# EAGLE design Arduino_backplane (EAGLE 6.4)
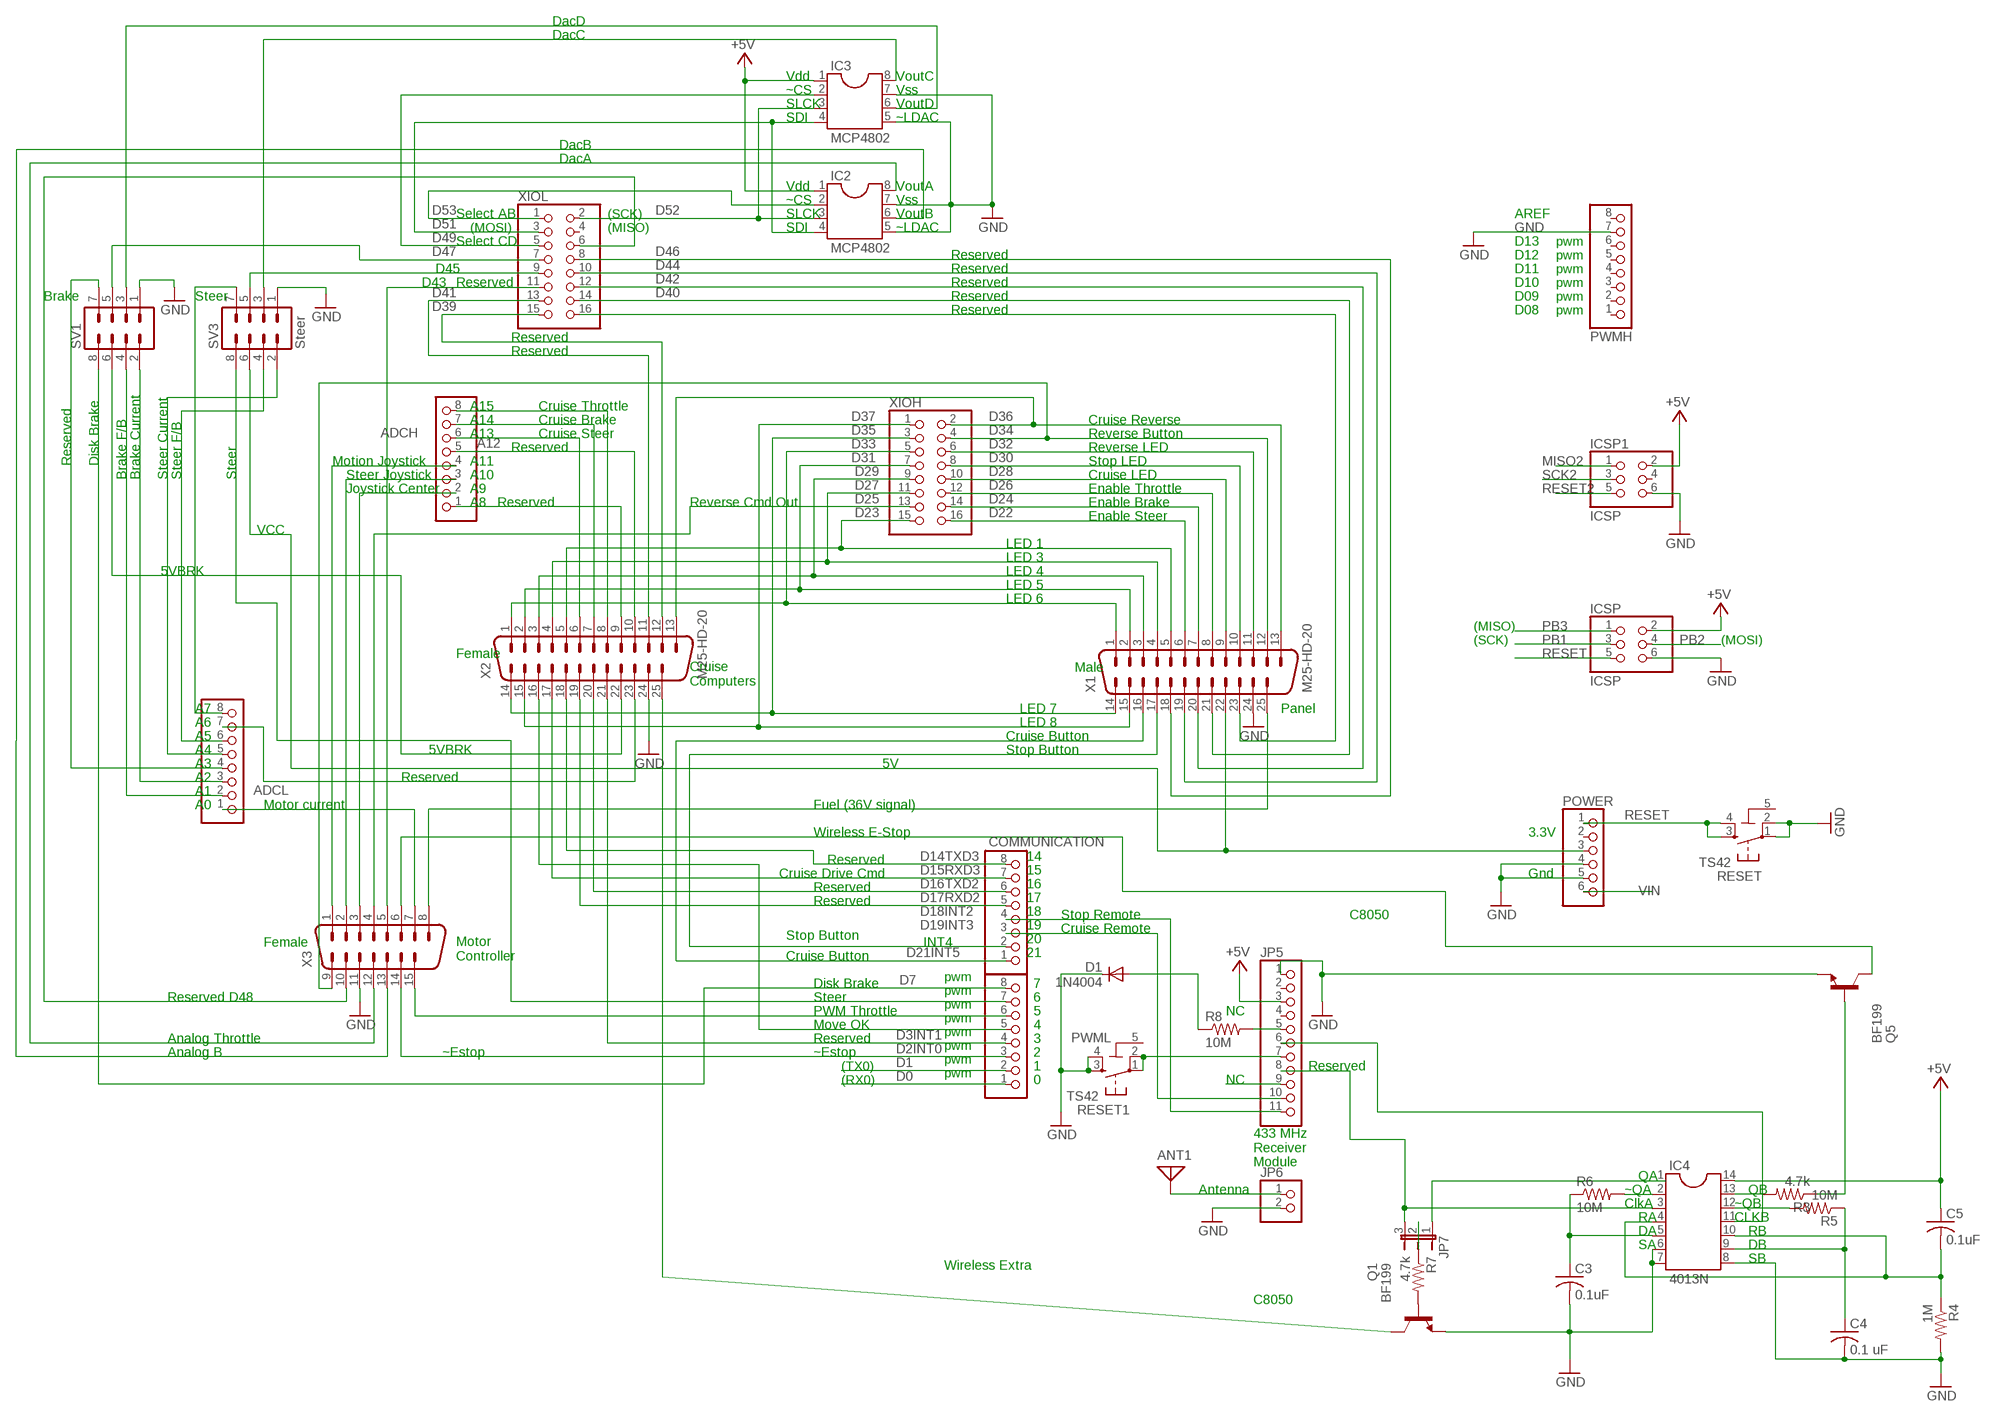
[diagram p0: schematic, sheet 1]

## Parts
ADCH  PINHD-1X8  [1X08]
ADCL  PINHD-1X8  [1X08]
ANT1  ANTENNA  [PAD-01]
C3  0.1uF  C-US025-025X050  [C025-025X050]
C4  0.1 uF  C-US025-025X050  [C025-025X050]
C5  0.1uF  C-US025-025X050  [C025-025X050]
COMMUNICATION  PINHD-1X8  [1X08]
D1  1N4004  [DO41-10]
IC2  MCP4802  DIL8  [DIL08]
IC3  MCP4802  DIL8  [DIL08]
IC4  4013N  DIL14  [DIL14]
ICSP  ICSP  PINHD-2X3  [2X03]
ICSP1  ICSP  PINHD-2X3  [2X03]
JP5  PINHD-1X11  [1X11]
JP6  PINHD-1X2  [1X02]
JP7  JP2E  [JP2]
POWER  PINHD-1X6  [1X06]
PWMH  PINHD-1X8  [1X08]
PWML  PINHD-1X8  [1X08]
Q1  BF199  [TO92]
Q5  BF199  [TO92]
R3  4.7k  R-US_0204/5  [0204/5]
R4  1M  R-US_0204/5  [0204/5]
R5  10M  R-US_0204/5  [0204/5]
R6  10M  R-US_0204/5  [0204/5]
R7  4.7k  R-US_0204/5  [0204/5]
R8  10M  R-US_0204/5  [0204/5]
RESET  TS42  [TS42]
RESET1  TS42  [TS42]
SV1  MA04-2  [MA04-2]
SV3  Steer  MA04-2  [MA04-2]
X1  M25-HD-20  [M25-HD-20]
X2  M25-HD-20  [M25-HD-20]
X3  M15HP  [M15HP]
XIOH  PINHD-2X8  [2X08]
XIOL  PINHD-2X8  [2X08]

## Nets
5VBRK: SV1.6 X2.22
+5V: C5.1 IC2.1 IC3.1 IC4.14 ICSP1.2 ICSP.2 JP5.3
A0: ADCL.1 X3.7
A1: ADCL.2 SV1.4
A3: ADCL.4 SV1.7
A4: ADCL.5 SV3.2
A5: ADCL.6 SV3.4
A6: ADCL.7 X2.23
A7: ADCL.8 SV3.7
A9: ADCH.2 X3.3
A10: ADCH.3 X3.2
A11: ADCH.4 X3.1
A12: ADCH.5 X2.10
A13: ADCH.6 X2.6
A14: ADCH.7 X2.7
A15: ADCH.8 X2.8
CLKA: IC4.3 JP5.8 JP7.3
CLKB: IC4.11 JP5.6
D0: PWML.1
D1: PWML.2
D2INT0: PWML.3 X3.14
D3INT1: PWML.4 X2.21
D4: PWML.5 X2.16
D5: PWML.6 X3.15
D6: PWML.7 SV3.8
D7: PWML.8 SV1.8
D14TXD3: COMMUNICATION.8 X2.18
D15RXD3: COMMUNICATION.7 X2.17
D16TXD2: COMMUNICATION.6 X2.20
D17RXD2: COMMUNICATION.5 X2.19
D18INT2: COMMUNICATION.4 JP5.11
D19INT3: COMMUNICATION.3 JP5.10
D20INT4: COMMUNICATION.2 X1.17
D21INT5: COMMUNICATION.1 X1.16
D22: X1.6 XIOH.16
D23: ADCH.1 X1.5 X2.5 X2.9 XIOH.15
D24: X1.7 XIOH.14
D25: X3.4 XIOH.13
D26: X1.8 XIOH.12
D27: X1.4 X2.4 XIOH.11
D28: X1.9 XIOH.10
D29: X1.3 X2.3 XIOH.9
D30: X1.10 XIOH.8
D31: X1.2 X2.2 XIOH.7
D32: X1.11 XIOH.6
D33: X1.1 X2.1 XIOH.5
D34: X1.12 XIOH.4
D35: X1.14 X2.14 XIOH.3
D36: X1.13 X2.13 XIOH.2
D37: X1.15 X2.15 XIOH.1
D38: X1.23 XIOL.16
D39: X2.12 XIOL.15
D40: X1.21 XIOL.14
D41: X2.11 XIOL.13
D42: X1.20 XIOL.12
D43: X3.5 XIOL.11
D44: X1.19 XIOL.10
D45: SV3.5 XIOL.9
D46: X1.18 XIOL.8
D47: SV1.5 XIOL.7
D48: X3.10 XIOL.6
D49: IC3.2 XIOL.5
D51: IC2.4 IC3.4 XIOL.3
D52: IC2.3 IC3.3 XIOL.2
D53: IC2.2 XIOL.1
DA: C3.1 IC4.5 R6.1
DACA: IC2.8 X3.12
DACB: IC2.6 X3.13
DACC: IC3.8 SV3.3
DACD: IC3.6 SV1.3
DB: C4.1 IC4.9 R5.1
FUEL: X1.25 X3.8
GND: C3.2 C4.2 D1.C IC2.5 IC2.7 IC3.5 IC3.7 IC4.6 IC4.7 IC4.8 ICSP1.6 ICSP.6 JP5.1 JP6.2 POWER.4 POWER.5 PWMH.7 Q1.2(E) Q5.2(E) R4.2 RESET1.3 RESET1.4 RESET.1 RESET.2 SV1.1 SV3.1 X1.24 X2.24 X3.11
MISO2: ICSP1.1
N$1: ADCL.3 SV1.2
N$3: JP5.5 R8.2
N$11: JP7.2 R7.1
N$12: Q1.1(B) R7.2
N$26: ANT1.1 JP6.1
N$28: JP5.7 RESET1.1 RESET1.2
N$29: JP5.9
N$33: Q5.1(B) R3.1
N$40: D1.A R8.1
PB1: ICSP.3
PB2: ICSP.4
PB3: ICSP.1
QA: IC4.1 JP7.1
QB: R3.2
RA: C5.2 IC4.4 IC4.10 R4.1
RESET: ICSP.5 POWER.1 RESET.3 RESET.4
RESET2: ICSP1.5
SCK2: ICSP1.3
VCC: POWER.3 SV3.6 X1.22
VIN: POWER.6
WLES: Q5.3(C) X3.6
WLX: Q1.3(C) X2.25
~QA: IC4.2 R6.2
~QB: IC4.12 R5.2
Unconnected: IC4.13 ICSP1.4 JP5.2 JP5.4 POWER.2 PWMH.1 PWMH.2 PWMH.3 PWMH.4 PWMH.5 PWMH.6 PWMH.8 X3.9 XIOL.4

## Notes on the sheet
- DacD
- DacC
- Vdd | VoutC
- ~CS | Vss
- SLCK | VoutD
- SDI | ~LDAC
- DacB
- DacA
- Vdd | VoutA
- ~CS | Vss
- Select AB | (SCK) | SLCK | VoutB | AREF
- (MOSI) | (MISO) | SDI | ~LDAC
- Select CD | D13 | pwm
- Reserved | D12 | pwm
- D45 | Reserved | D11 | pwm
- D43 | Reserved | Reserved | D10 | pwm
- Brake | Steer | Reserved | D09 | pwm
- Reserved | D08 | pwm
- Reserved
- Reserved
- A15 | Cruise Throttle
- A14 | Cruise Brake | Cruise Reverse
- A13 | Cruise Steer | Reverse Button
- Reserved | Reverse LED
- Reserved | Disk Brake | Motion Joystick | A11 | Stop LED
- Brake F/B | Brake Current | Steer Current | Steer F/B | Steer | Steer Joystick | A10 | Cruise LED
- Joystick Center | A9 | Enable Throttle
- A8 | Reserved | Reverse Cmd Out | Enable Brake
- Enable Steer
- VCC
- LED 1
- LED 3
- 5VBRK | LED 4
- LED 5
- LED 6
- (MISO)
- (SCK) | (MOSI)
- Female
- Male
- Cruise
  Computers
- A7 | LED 7 | Panel
- A6 | LED 8
- A5 | Cruise Button
- A4 | 5VBRK | Stop Button
- A3 | 5V
- A2 | Reserved
- A1
- A0 | Motor current | Fuel (36V signal)
- Wireless E-Stop | 3.3V
- Reserved | 14
- Cruise Drive Cmd | 15 | Gnd
- Reserved | 16
- Reserved | 17
- 18 | Stop Remote | C8050
- 19 | Cruise Remote
- Stop Button | 20
- Female | INT4
- 21
- Motor
  Controller
- Cruise Button
- pwm
- Disk Brake | 7
- pwm
- Reserved D48 | Steer | 6
- pwm
- PWM Throttle | 5 | NC
- pwm
- Move OK | 4
- pwm
- Analog Throttle | Reserved | 3
- pwm
- Analog B | ~Estop | ~Estop | 2
- pwm
- (TX0) | 1 | Reserved
- pwm
- (RX0) | 0 | NC
- 433 MHz
  Receiver
  Module
- QA
- Antenna | ~QA | QB
- ClkA | ~QB
- RA | CLKB
- DA | RB
- SA | DB
- SB
- Wireless Extra
- C8050

## Power pins joined to a net without a drawn wire
5-GND: RESET1.5(5-GND) RESET.5(5-GND)

## Library data of the parts
ADCH ADCL COMMUNICATION PWMH PWML = pinhead:PINHD-1X8: PIN HEADER
ANT1 = discrete:ANTENNA: Antenna
C3-C5 = rcl:C-US: CAPACITOR, American symbol
D1 = diode:1N4004: DIODE general purpose rectifier, 1 A
IC2 IC3 = ic-package:DIL8: Dual In Line / Socket
IC4 = ic-package:DIL14: Dual In Line / Socket
ICSP ICSP1 = pinhead:PINHD-2X3: PIN HEADER
JP5 = pinhead:PINHD-1X11: PIN HEADER
JP6 = pinhead:PINHD-1X2: PIN HEADER
JP7 = jumper:JP2E: JUMPER
POWER = pinhead:PINHD-1X6: PIN HEADER
Q1 Q5 = transistor-npn:BF199*: NPN Transistor
R3-R8 = rcl:R-US_: RESISTOR, American symbol
RESET RESET1 = st-mod v1.4:TS42: TS42 Dongnan Electronics Tact switch VDC 12V - 50mA
SV1 SV3 = con-lstb:MA04-2: PIN HEADER; OC_FARNELL: unknown; OC_NEWARK: unknown
X1 X2 = con-subd:M25-HD-20: HD-20 Front Metal-Shell Right-Angle Posted Connectors 318 Mount 5747846-6 Source: http://catalog.tycoelectronics.com/TE/bin/TE.Connect?C=1&M=BYPN&TCPN=5747846-6&RQPN=5747846-6; OC_FARNELL: unknown; OC_NEWARK: unknown
X3 = con-subd:M15: SUB-D; OC_FARNELL: unknown; OC_NEWARK: unknown
XIOH XIOL = pinhead:PINHD-2X8: PIN HEADER

## Net classes
0 default: width 0.152 mm, drill 0.305 mm, clearance 0.152 mm

## Board
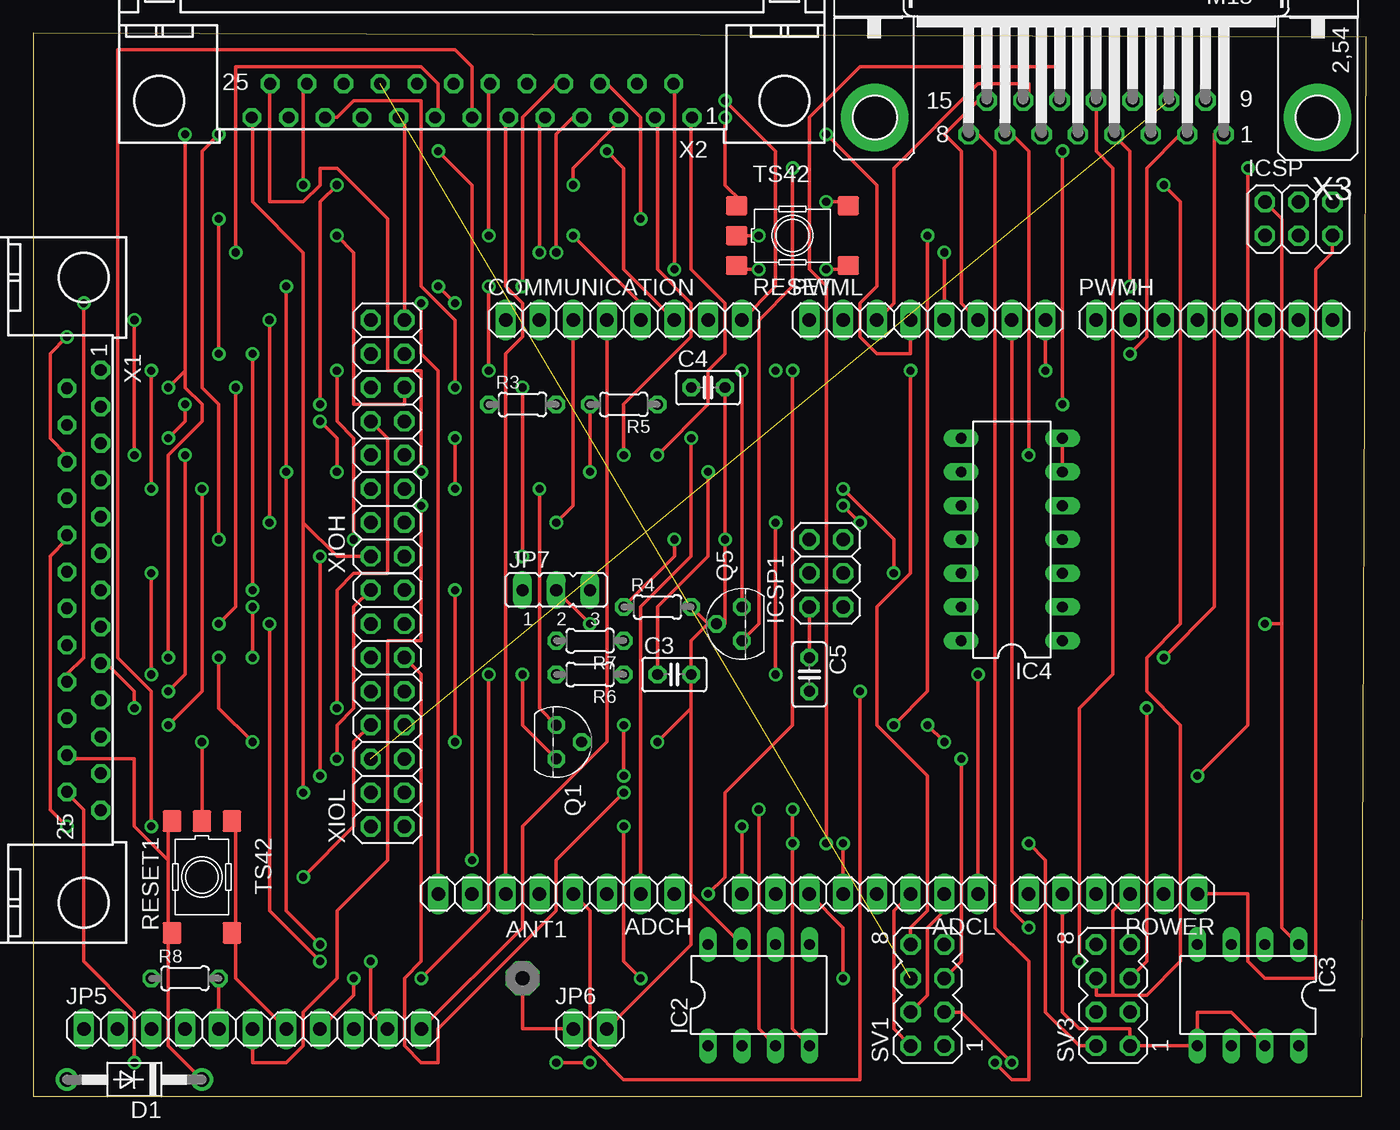
[diagram p1: board, top side]
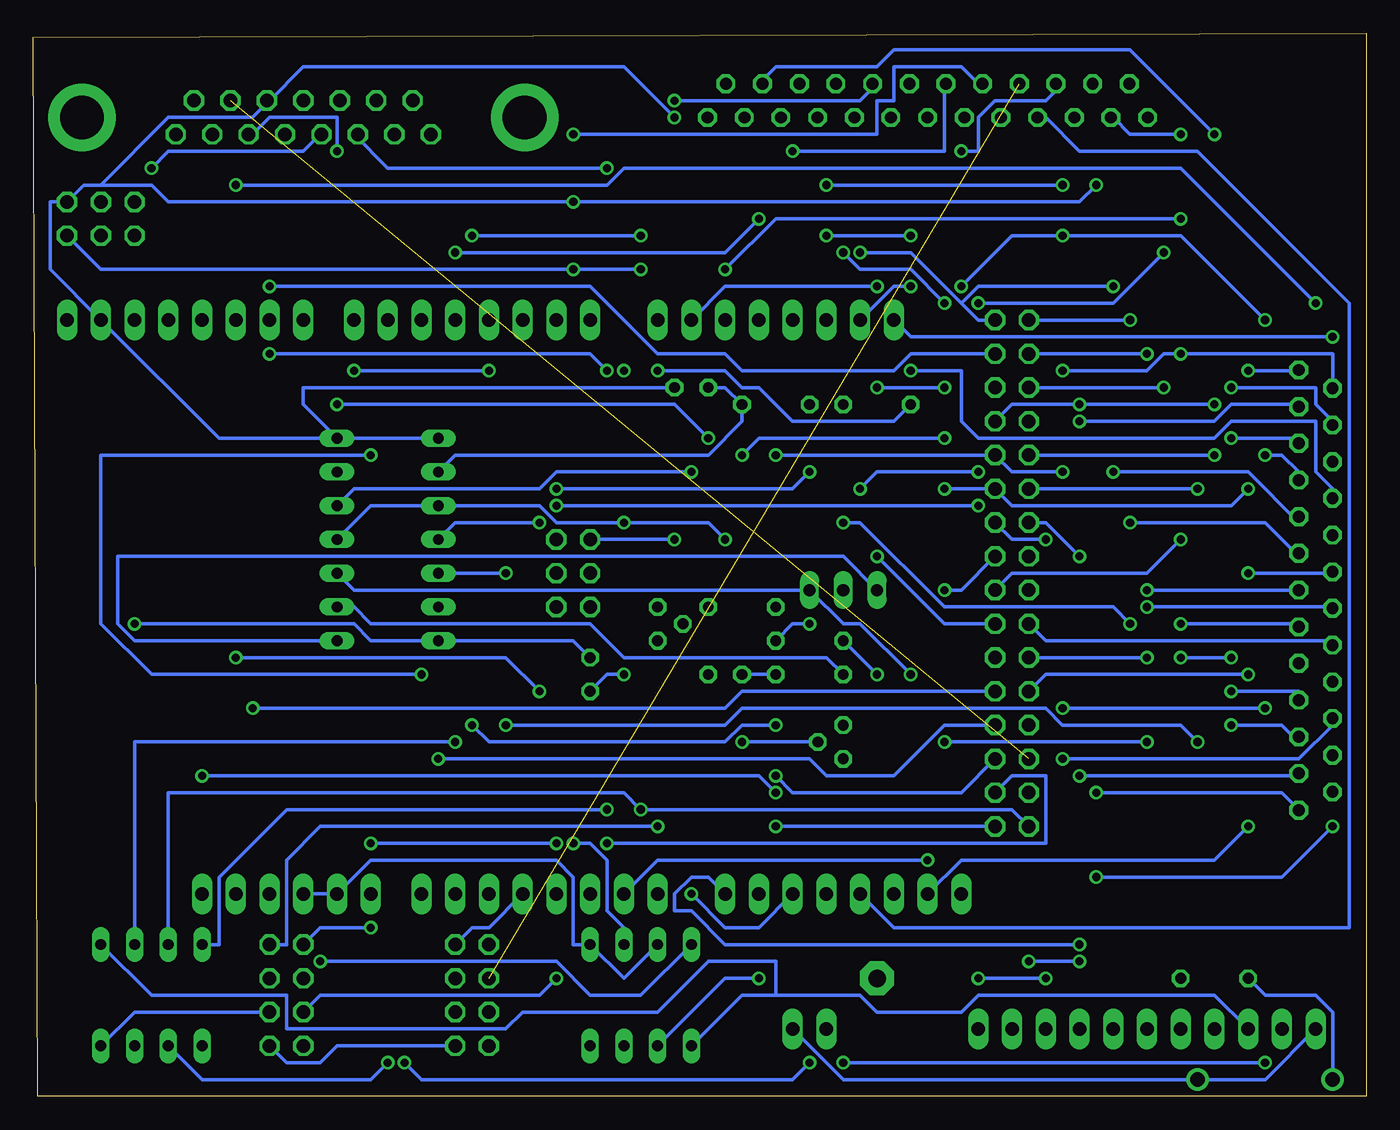
[diagram p2: board, bottom side, seen from below]

Size 100.34 x 80 mm. Coordinates in mm from the lower left corner, seen from the top.
Outline: 0,0 100,0 100.34,79.68 0,80 0,0
Copper layers (1*16): Top 0.035mm / dielectric 1.5mm / Bottom 0.035mm
Design rules "default": minimum track width 10mil, minimum drill 24mil, track to track 8mil, track to pad 8mil, pad to pad 8mil, via to via 8mil, smd to smd 8mil, copper to edge 40mil, drill to drill 8mil, minimum pad ring 10mil, minimum via ring 8mil, stop-mask expansion 4mil, vias tented up to drill 0mil, thermal gap 10mil

### Footprints (pad centres in the part's own frame; a part is rotated, then mirrored left to right if it is on the bottom)
1X08 = drill 1.016 long: 1 -8.89,0; 2 -6.35,0; 3 -3.81,0; 4 -1.27,0; 5 1.27,0; 6 3.81,0; 7 6.35,0; 8 8.89,0
PAD-01 = drill 1.321 pad 2.54 octagon: 1 0,0
C025-025X050 = drill 0.813 octagon: 1 -1.27,0; 2 1.27,0
DO41-10 = drill 1.118: A 5.08,0; C -5.08,0
DIL08 = drill 0.813 long: 1 -3.81,-3.81; 2 -1.27,-3.81; 3 1.27,-3.81; 4 3.81,-3.81; 5 3.81,3.81; 6 1.27,3.81; 7 -1.27,3.81; 8 -3.81,3.81
DIL14 = drill 0.813 long: 1 -7.62,-3.81; 2 -5.08,-3.81; 3 -2.54,-3.81; 4 0,-3.81; 5 2.54,-3.81; 6 5.08,-3.81; 7 7.62,-3.81; 8 7.62,3.81; 9 5.08,3.81; 10 2.54,3.81; 11 0,3.81; 12 -2.54,3.81; 13 -5.08,3.81; 14 -7.62,3.81
2X03 = drill 1.016 octagon: 1 -2.54,-1.27; 2 -2.54,1.27; 3 0,-1.27; 4 0,1.27; 5 2.54,-1.27; 6 2.54,1.27
1X11 = drill 1.016 long: 1 -12.7,0; 2 -10.16,0; 3 -7.62,0; 4 -5.08,0; 5 -2.54,0; 6 0,0; 7 2.54,0; 8 5.08,0; 9 7.62,0; 10 10.16,0; 11 12.7,0
1X02 = drill 1.016 long: 1 -1.27,0; 2 1.27,0
JP2 = drill 0.914 long: 1 -2.54,0; 2 0,0; 3 2.54,0
1X06 = drill 1.016 long: 1 -6.35,0; 2 -3.81,0; 3 -1.27,0; 4 1.27,0; 5 3.81,0; 6 6.35,0
TO92 = drill 0.813 octagon: 1 1.27,0; 2 0,1.905; 3 -1.27,0
0204/5 = drill 0.813 octagon: 1 -2.54,0; 2 2.54,0
TS42 = smd 1.6 x 1.4: 1 -4.2,2.25; 2 4.2,2.25; 3 -4.2,-2.25; 4 4.2,-2.25; 5 -4.2,0
MA04-2 = drill 1.016 octagon: 1 -3.81,-1.27; 2 -3.81,1.27; 3 -1.27,-1.27; 4 -1.27,1.27; 5 1.27,-1.27; 6 1.27,1.27; 7 3.81,-1.27; 8 3.81,1.27
M25-HD-20 = drill 0.9 pad 1.3 octagon: 1 -16.561,1.27; 2 -13.792,1.27; 3 -11.049,1.27; 4 -8.28,1.27; 5 -5.512,1.27; 6 -2.769,1.27; 7 0,1.27; 8 2.769,1.27; 9 5.512,1.27; 10 8.28,1.27; 11 11.049,1.27; 12 13.792,1.27; 13 16.561,1.27; 14 -15.189,-1.27; 15 -12.421,-1.27; 16 -9.652,-1.27; 17 -6.909,-1.27; 18 -4.14,-1.27; 19 -1.372,-1.27; 20 1.372,-1.27; 21 4.14,-1.27; 22 6.909,-1.27; 23 9.652,-1.27; 24 12.421,-1.27; 25 15.189,-1.27
M15HP = drill 1.016 octagon: 1 -9.601,1.27; 2 -6.858,1.27; 3 -4.115,1.27; 4 -1.372,1.27; 5 1.372,1.27; 6 4.115,1.27; 7 6.858,1.27; 8 9.601,1.27; 9 -8.23,-1.27; 10 -5.486,-1.27; 11 -2.743,-1.27; 12 0,-1.27; 13 2.743,-1.27; 14 5.486,-1.27; 15 8.23,-1.27 | drill 3.302 pad 5.08: G1 -16.662,0; G2 16.662,0
2X08 = drill 1.016 octagon: 1 -8.89,-1.27; 2 -8.89,1.27; 3 -6.35,-1.27; 4 -6.35,1.27; 5 -3.81,-1.27; 6 -3.81,1.27; 7 -1.27,-1.27; 8 -1.27,1.27; 9 1.27,-1.27; 10 1.27,1.27; 11 3.81,-1.27; 12 3.81,1.27; 13 6.35,-1.27; 14 6.35,1.27; 15 8.89,-1.27; 16 8.89,1.27

### Placement (x,y rotation side)
ADCH  39.37,15.24 180 top
ADCL  62.23,15.24 180 top
ANT1  36.83,8.89 0 top
C3  48.26,31.75 0 top
C4  50.8,53.34 0 top
C5  58.42,31.75 270 top
COMMUNICATION  44.45,58.42 0 top
D1  7.62,1.27 180 top
IC2  54.61,7.62 0 top
IC3  91.44,7.62 180 top
IC4  73.66,41.91 90 top
ICSP  95.25,66.04 0 top
ICSP1  59.69,39.37 90 top
JP5  16.51,5.08 0 top
JP6  41.91,5.08 0 top
JP7  39.37,38.1 0 top
POWER  81.28,15.24 180 top
PWMH  88.9,58.42 0 top
PWML  67.31,58.42 0 top
Q1  39.37,26.67 270 top
Q5  53.34,35.56 90 top
R3  36.83,52.07 0 top
R4  46.99,36.83 0 top
R5  44.45,52.07 180 top
R6  41.91,31.75 180 top
R7  41.91,34.29 180 top
R8  11.43,8.89 0 top
RESET  57.15,64.77 0 top
RESET1  12.7,16.51 270 top
SV1  67.31,7.62 90 top
SV3  81.28,7.62 90 top
X1  3.81,38.1 270 top
X2  33.02,74.93 180 top
X3  80.01,73.66 180 top
XIOH  26.67,49.53 90 top
XIOL  26.67,29.21 90 top

### Tracks (layer width: path | path; a pad name or v marks a point on that pad's centre or on a via)
5-GND  (via drill 0.61)
  Top 0.254: v12.7,26.67 RESET1.5 12.7,20.32 | v64.77,27.94 67.31,30.48 v67.31,64.77 | RESET.5 v54.61,64.77
  Bottom 0.254: v12.7,26.67 13.97,27.94 22.86,27.94 24.13,29.21 46.99,29.21 48.26,27.94 v64.77,27.94 | v54.61,64.77 v67.31,64.77
5VBRK  (1 unrouted)
+5V  (via drill 0.61)
  Top 0.254: ICSP1.2 C5.1 | IC3.1 93.98,12.7 93.98,35.56 | 93.98,35.56 93.98,66.04 ICSP.2 | 93.98,35.56 v92.71,35.56
  Bottom 0.254: IC2.1 46.99,7.62 44.45,7.62 | 44.45,7.62 38.1,7.62 36.83,6.35 30.48,6.35 29.21,7.62 11.43,7.62 JP5.3 | C5.1 59.69,34.29 IC4.14 74.93,34.29 76.2,35.56 v92.71,35.56 | 44.45,7.62 44.45,10.16 49.53,10.16 53.34,6.35 63.5,6.35 64.77,5.08 81.28,5.08 81.28,7.62 91.44,7.62 IC3.1
A0  (via drill 0.61)
  Top 0.254: v71.12,31.75 ADCL.1 | v74.93,48.26 74.93,71.12 73.66,72.39 X3.7
  Bottom 0.254: v71.12,31.75 91.44,31.75 95.25,35.56 95.25,48.26 v74.93,48.26
A1
  Top 0.254: SV1.4 67.31,7.62 67.31,12.7 68.58,13.97 ADCL.2
A3
  Bottom 0.254: SV1.7 67.31,12.7 66.04,12.7 ADCL.4
A4  (via drill 0.61)
  Top 0.254: v60.96,19.05 ADCL.5 | v74.93,19.05 76.2,17.78 76.2,6.35 78.74,3.81 SV3.2
  Bottom 0.254: v74.93,19.05 v60.96,19.05
A5  (via drill 0.61)
  Top 0.254: ADCL.6 60.96,12.7 v60.96,8.89
  Bottom 0.254: v60.96,8.89 62.23,7.62 78.74,7.62 SV3.4
A6  (via drill 0.61)
  Top 0.254: v30.48,71.12 33.02,68.58 v33.02,17.78
  Bottom 0.254: v30.48,71.12 29.21,71.12 29.21,73.66 27.94,74.93 24.13,74.93 22.86,76.2 X2.23 | v33.02,17.78 53.34,17.78 ADCL.7
A7  (via drill 0.61)
  Top 0.254: v53.34,20.32 ADCL.8
  Bottom 0.254: v53.34,20.32 78.74,20.32 81.28,17.78 81.28,11.43 SV3.7
A9  (via drill 0.61)
  Top 0.254: ADCH.2 45.72,36.83 49.53,40.64 v49.53,49.53 | v77.47,71.12 v77.47,52.07
  Bottom 0.254: v49.53,49.53 52.07,52.07 v77.47,52.07 | v77.47,71.12 77.47,73.66 82.55,73.66 83.82,72.39 X3.3
A10  (via drill 0.61)
  Top 0.254: v50.8,15.24 52.07,16.51 52.07,22.86 57.15,27.94 v57.15,54.61 | v82.55,55.88 83.82,57.15 83.82,69.85 86.36,72.39 X3.2
  Bottom 0.254: ADCH.3 45.72,12.7 48.26,12.7 v50.8,15.24 | v57.15,54.61 58.42,55.88 v82.55,55.88
A11  (via drill 0.61)
  Top 0.254: ADCH.4 41.91,13.97 41.91,3.81 44.45,1.27 62.23,1.27 v62.23,30.48 | v85.09,33.02 88.9,36.83 88.9,72.39 X3.1
  Bottom 0.254: v62.23,30.48 64.77,33.02 v85.09,33.02
A12
  Bottom 0.254: ADCH.5 35.56,12.7 1.27,12.7 1.27,59.69 12.7,71.12 21.59,71.12 24.13,73.66 X2.10
A13
  Top 0.254: ADCH.6 35.56,55.88 36.83,57.15 36.83,59.69 35.56,60.96 35.56,73.66 X2.6
A14  (via drill 0.61)
  Top 0.254: X2.7 33.02,77.47 31.75,78.74 6.35,78.74 6.35,33.02 8.89,30.48 v8.89,20.32
  Bottom 0.254: v8.89,20.32 11.43,17.78 30.48,17.78 ADCH.7
A15  (via drill 0.61)
  Top 0.254: v15.24,63.5 15.24,77.47 29.21,77.47 30.48,76.2 30.48,73.66 X2.8 | v29.21,59.69 29.21,55.88 30.48,54.61 ADCH.8
  Bottom 0.254: v15.24,63.5 19.05,59.69 v29.21,59.69
CLKA  (via drill 0.61)
  Top 0.254: JP5.8 24.13,7.62 v24.13,8.89 | v29.21,8.89 34.29,13.97 v34.29,31.75
  Bottom 0.254: IC4.3 76.2,38.1 JP7.3 39.37,35.56 38.1,35.56 v34.29,31.75 | v29.21,8.89 v24.13,8.89
CLKB  (via drill 0.61)
  Top 0.254: v60.96,44.45 v62.23,43.18 | v29.21,44.45 29.21,34.29 26.67,34.29 26.67,17.78 22.86,13.97 22.86,8.89 20.32,6.35 20.32,3.81 19.05,2.54 16.51,2.54 JP5.6
  Bottom 0.254: IC4.11 68.58,43.18 v62.23,43.18 | v29.21,44.45 v60.96,44.45
D2INT0
  Top 0.254: PWML.3 64.77,59.69 64.77,69.85 71.12,76.2 74.93,76.2 74.93,74.93 X3.14
D3INT1  (via drill 0.61)
  Top 0.254: v59.69,72.39 63.5,68.58 63.5,60.96 62.23,59.69 62.23,57.15 63.5,55.88 66.04,55.88 PWML.4
  Bottom 0.254: v59.69,72.39 36.83,72.39 36.83,74.93 35.56,74.93 35.56,77.47 30.48,77.47 29.21,76.2 X2.21
D4  (via drill 0.61)
  Top 0.254: v45.72,66.04 45.72,73.66 43.18,76.2 X2.16 | PWML.5 v68.58,63.5
  Bottom 0.254: v45.72,66.04 48.26,63.5 v68.58,63.5
D5
  Top 0.254: PWML.6 69.85,59.69 69.85,71.12 68.58,72.39 71.12,74.93 X3.15
D6  (via drill 0.61)
  Top 0.254: v74.93,12.7 73.66,13.97 PWML.7
  Bottom 0.254: SV3.8 78.74,12.7 v74.93,12.7
D7  (via drill 0.61)
  Top 0.254: SV1.8 66.04,12.7 67.31,13.97 67.31,24.13 63.5,27.94 63.5,36.83 66.04,39.37 v66.04,54.61 | PWML.8 v76.2,54.61
  Bottom 0.254: v76.2,54.61 v66.04,54.61
D14TXD3  (via drill 0.61)
  Top 0.254: v52.07,74.93 55.88,71.12 55.88,60.96 COMMUNICATION.8
  Bottom 0.254: v52.07,74.93 38.1,74.93 36.83,76.2 X2.18
D15RXD3  (via drill 0.61)
  Top 0.254: v36.83,60.96 36.83,73.66 39.37,76.2 X2.17
  Bottom 0.254: v36.83,60.96 48.26,60.96 COMMUNICATION.7
D16TXD2  (via drill 0.61)
  Top 0.254: v43.18,71.12 44.45,69.85 44.45,62.23 COMMUNICATION.6
  Bottom 0.254: v43.18,71.12 31.75,71.12 31.75,76.2 X2.20
D17RXD2  (via drill 0.61)
  Top 0.254: v34.29,64.77 34.29,76.2 X2.19 | v40.64,64.77 45.72,59.69 COMMUNICATION.5
  Bottom 0.254: v40.64,64.77 v34.29,64.77
D18INT2
  Top 0.254: JP5.11 36.83,12.7 36.83,20.32 43.18,26.67 COMMUNICATION.4
D19INT3  (via drill 0.61)
  Top 0.254: JP5.10 25.4,6.35 v25.4,10.16 | v21.59,10.16 17.78,13.97 v17.78,35.56 | v39.37,43.18 40.64,44.45 COMMUNICATION.3
  Bottom 0.254: v21.59,10.16 v25.4,10.16 | v17.78,35.56 19.05,36.83 31.75,36.83 38.1,43.18 v39.37,43.18
D20INT4  (via drill 0.61)
  Top 0.254: v34.29,60.96 v34.29,54.61
  Bottom 0.254: v34.29,54.61 30.48,54.61 30.48,50.8 29.21,49.53 11.43,49.53 10.16,50.8 3.81,50.8 3.81,46.99 2.54,45.72 X1.17 2.54,44.45 | v34.29,60.96 35.56,60.96 COMMUNICATION.2
D21INT5  (via drill 0.61)
  Top 0.254: v2.54,57.15 1.27,55.88 1.27,49.53 2.54,48.26 X1.16
  Bottom 0.254: v2.54,57.15 34.29,57.15 COMMUNICATION.1
D22  (via drill 0.61)
  Top 0.254: v17.78,58.42 v17.78,43.18
  Bottom 0.254: v17.78,43.18 7.62,43.18 5.08,40.64 X1.6 | XIOH.16 v17.78,58.42
D23  (via drill 0.61)
  Top 0.254: v19.05,60.96 v19.05,46.99 19.05,13.97 v21.59,11.43 | XIOH.15 27.94,73.66 X2.9 | v38.1,63.5 38.1,73.66 X2.5
  Bottom 0.254: v19.05,46.99 8.89,46.99 5.08,43.18 X1.5 | v19.05,60.96 29.21,60.96 30.48,59.69 | 30.48,59.69 29.21,58.42 XIOH.15 | v38.1,63.5 34.29,63.5 30.48,59.69 | ADCH.1 49.53,16.51 50.8,16.51 52.07,15.24 52.07,13.97 50.8,13.97 48.26,11.43 v21.59,11.43
D24  (via drill 0.61)
  Top 0.254: v16.51,55.88 v16.51,38.1
  Bottom 0.254: v16.51,38.1 X1.7 | XIOH.14 v16.51,55.88
D25  (via drill 0.61)
  Top 0.254: v82.55,60.96 82.55,71.12 81.28,72.39 X3.4
  Bottom 0.254: XIOH.13 34.29,55.88 35.56,54.61 46.99,54.61 48.26,55.88 53.34,55.88 58.42,60.96 v82.55,60.96
D26  (via drill 0.61)
  Top 0.254: v13.97,35.56 15.24,36.83 v15.24,53.34
  Bottom 0.254: v13.97,35.56 5.08,35.56 X1.8 | XIOH.12 v15.24,53.34
D27  (via drill 0.61)
  Top 0.254: v7.62,58.42 v7.62,48.26 | v22.86,64.77 24.13,63.5 24.13,52.07 27.94,52.07 XIOH.11 | v39.37,63.5 39.37,72.39 40.64,73.66 X2.4 | v30.48,60.96 v31.75,59.69
  Bottom 0.254: v7.62,48.26 6.35,48.26 5.08,46.99 X1.4 | v7.62,58.42 13.97,64.77 v22.86,64.77 26.67,64.77 v30.48,60.96 | v39.37,63.5 38.1,62.23 34.29,62.23 v31.75,59.69
D28  (via drill 0.61)
  Top 0.254: v7.62,29.21 7.62,30.48 5.08,33.02 X1.9 | v22.86,29.21 22.86,38.1 24.13,39.37 26.67,39.37 26.67,49.53 XIOH.10
  Bottom 0.254: v22.86,29.21 v7.62,29.21
D29  (via drill 0.61)
  Top 0.254: v10.16,49.53 11.43,50.8 v11.43,52.07 | v40.64,68.58 40.64,69.85 44.45,73.66 X2.3 | v22.86,68.58 21.59,67.31 v21.59,52.07
  Bottom 0.254: v10.16,49.53 5.08,49.53 X1.3 | v11.43,52.07 v21.59,52.07 26.67,52.07 XIOH.9 | v22.86,68.58 v40.64,68.58
D30  (via drill 0.61)
  Top 0.254: v10.16,30.48 11.43,31.75 v11.43,48.26
  Bottom 0.254: v10.16,30.48 5.08,30.48 X1.10 | XIOH.8 v11.43,48.26
D31  (via drill 0.61)
  Top 0.254: v21.59,50.8 22.86,49.53 v22.86,46.99 | v44.45,48.26 44.45,52.07 49.53,57.15 49.53,59.69 46.99,62.23 46.99,73.66 X2.2
  Bottom 0.254: v21.59,50.8 11.43,50.8 10.16,52.07 5.08,52.07 X1.2 | v22.86,46.99 26.67,46.99 XIOH.7 v44.45,48.26
D32  (via drill 0.61)
  Top 0.254: v10.16,27.94 12.7,30.48 v12.7,45.72
  Bottom 0.254: v10.16,27.94 6.35,27.94 5.08,26.67 X1.11 | XIOH.6 v12.7,45.72
D33  (via drill 0.61)
  Top 0.254: v8.89,45.72 v8.89,54.61 | v46.99,48.26 50.8,52.07 50.8,54.61 52.07,55.88 52.07,59.69 49.53,62.23 49.53,73.66 X2.1 | v31.75,45.72 v31.75,49.53
  Bottom 0.254: v8.89,54.61 5.08,54.61 X1.1 | v8.89,45.72 10.16,44.45 26.67,44.45 XIOH.5 v31.75,45.72 | v46.99,48.26 45.72,49.53 v31.75,49.53
D34  (via drill 0.61)
  Top 0.254: v21.59,40.64 v21.59,24.13
  Bottom 0.254: v21.59,24.13 5.08,24.13 X1.12 | v21.59,40.64 24.13,43.18 XIOH.4
D35  (via drill 0.61)
  Top 0.254: v22.86,54.61 22.86,50.8 24.13,49.53 v24.13,41.91 | v48.26,62.23 48.26,76.2 X2.14 | v13.97,55.88 v13.97,66.04
  Bottom 0.254: X1.14 2.54,55.88 v13.97,55.88 15.24,55.88 16.51,54.61 v22.86,54.61 | v24.13,41.91 26.67,41.91 XIOH.3 | v48.26,62.23 44.45,66.04 v13.97,66.04
D36  (via drill 0.61)
  Top 0.254: 20.32,43.18 20.32,63.5 16.51,67.31 16.51,73.66 X2.13 | 20.32,43.18 v20.32,22.86 | XIOH.2 22.86,40.64 20.32,43.18
  Bottom 0.254: v20.32,22.86 6.35,22.86 5.08,21.59 X1.13
D37  (via drill 0.61)
  Top 0.254: 11.43,54.61 v10.16,53.34 | v11.43,72.39 11.43,54.61 | v31.75,26.67 v31.75,38.1 | v16.51,26.67 13.97,29.21 v13.97,33.02 | v10.16,33.02 10.16,48.26 12.7,50.8 12.7,52.07 11.43,53.34 11.43,54.61
  Bottom 0.254: v10.16,53.34 3.81,53.34 3.81,52.07 2.54,50.8 X1.15 | v11.43,72.39 17.78,78.74 35.56,78.74 36.83,77.47 44.45,77.47 45.72,76.2 X2.15 | XIOH.1 30.48,38.1 v31.75,38.1 | v16.51,26.67 v31.75,26.67 | v10.16,33.02 v13.97,33.02
D38  (via drill 0.61)
  Top 0.254: v22.86,25.4 22.86,27.94 24.13,29.21 24.13,36.83 XIOL.16
  Bottom 0.254: v22.86,25.4 5.08,25.4 2.54,27.94 X1.23
D39  (via drill 0.61)
  Top 0.254: v13.97,72.39 12.7,71.12 12.7,53.34 13.97,52.07 v13.97,41.91
  Bottom 0.254: v13.97,72.39 17.78,72.39 19.05,73.66 X2.12 | v13.97,41.91 16.51,39.37 26.67,39.37 XIOL.15
D40
  Bottom 0.254: XIOL.14 24.13,34.29 2.54,34.29 X1.21
D41  (via drill 0.61)
  Top 0.254: v31.75,53.34 31.75,58.42 29.21,60.96 29.21,74.93 24.13,74.93 22.86,73.66 X2.11 21.59,73.66 | v36.83,40.64 v36.83,53.34
  Bottom 0.254: v36.83,53.34 v31.75,53.34 | v36.83,40.64 31.75,35.56 XIOL.13
D42  (via drill 0.61)
  Top 0.254: v16.51,33.02 v16.51,36.83
  Bottom 0.254: v16.51,36.83 2.54,36.83 X1.20 | XIOL.12 v16.51,33.02
D43  (via drill 0.61)
  Top 0.254: XIOL.11 29.21,31.75 29.21,10.16 27.94,8.89 27.94,3.81 29.21,2.54 30.48,2.54 30.48,5.08 39.37,13.97 39.37,17.78 v44.45,22.86 | v87.63,24.13 91.44,27.94 v91.44,69.85
  Bottom 0.254: v44.45,22.86 45.72,24.13 v87.63,24.13 | v91.44,69.85 90.17,71.12 80.01,71.12 78.74,72.39 X3.5
D44  (via drill 0.61)
  Top 0.254: v8.89,31.75 v8.89,39.37
  Bottom 0.254: v8.89,39.37 2.54,39.37 X1.19 | v8.89,31.75 24.13,31.75 XIOL.10
D45  (via drill 0.61)
  Top 0.254: v83.82,29.21 83.82,10.16 SV3.5
  Bottom 0.254: XIOL.9 46.99,30.48 48.26,29.21 v83.82,29.21
D46  (via drill 0.61)
  Top 0.254: v2.54,20.32 1.27,21.59 1.27,40.64 2.54,41.91 X1.18 | v20.32,16.51 24.13,20.32 24.13,26.67 XIOL.8
  Bottom 0.254: v2.54,20.32 6.35,16.51 v20.32,16.51
D47  (via drill 0.61)
  Top 0.254: SV1.5 69.85,10.16 v69.85,25.4
  Bottom 0.254: v69.85,25.4 41.91,25.4 40.64,24.13 35.56,24.13 31.75,27.94 XIOL.7
D48  (1 unrouted)
D49  (via drill 0.61)
  Top 0.254: v67.31,27.94 v68.58,26.67 | v44.45,24.13 v44.45,27.94
  Bottom 0.254: IC3.2 92.71,26.67 v68.58,26.67 | v67.31,27.94 66.04,26.67 48.26,26.67 46.99,27.94 v44.45,27.94 | v44.45,24.13 43.18,22.86 30.48,22.86 XIOL.5
D51  (via drill 0.61)
  Top 0.254: IC2.4 57.15,5.08 v57.15,19.05 v57.15,21.59
  Bottom 0.254: v57.15,21.59 81.28,21.59 86.36,16.51 86.36,11.43 IC3.4 | XIOL.3 26.67,24.13 24.13,24.13 24.13,19.05 v57.15,19.05
D52  (via drill 0.61)
  Top 0.254: IC2.3 54.61,5.08 v54.61,21.59
  Bottom 0.254: XIOL.2 26.67,21.59 v54.61,21.59 55.88,22.86 90.17,22.86 IC3.3
D53  (via drill 0.61)
  Top 0.254: v45.72,8.89 44.45,10.16 v44.45,20.32
  Bottom 0.254: IC2.2 48.26,8.89 v45.72,8.89 | XIOL.1 v44.45,20.32
DA  (via drill 0.61)
  Top 0.254: v50.8,46.99 50.8,40.64 46.99,36.83 C3.1
  Bottom 0.254: C3.1 R6.1 | IC4.5 76.2,45.72 62.23,45.72 60.96,46.99 v50.8,46.99
DACA  (via drill 0.61)
  Top 0.254: v78.74,10.16 78.74,29.21 81.28,31.75 81.28,69.85 80.01,71.12 X3.12
  Bottom 0.254: IC2.8 54.61,7.62 58.42,7.62 60.96,10.16 v78.74,10.16
DACB  (via drill 0.61)
  Top 0.254: v59.69,19.05 59.69,60.96 58.42,62.23 58.42,73.66 62.23,77.47 77.47,77.47 77.47,74.93 X3.13
  Bottom 0.254: IC2.6 55.88,12.7 57.15,13.97 57.15,17.78 58.42,19.05 v59.69,19.05
DACC
  Bottom 0.254: IC3.8 92.71,6.35 SV3.3
DACD  (via drill 0.61)
  Top 0.254: v73.66,2.54 69.85,6.35 SV1.3
  Bottom 0.254: IC3.6 87.63,1.27 74.93,1.27 v73.66,2.54
DB
  Bottom 0.254: C4.1 48.26,53.34 R5.1 46.99,50.8 49.53,48.26 68.58,48.26 IC4.9
FUEL  (via drill 0.61)
  Top 0.254: v7.62,2.54 7.62,6.35 3.81,10.16 3.81,21.59 2.54,22.86 X1.25 | v41.91,2.54 v39.37,2.54 | v72.39,2.54 73.66,1.27 74.93,1.27 74.93,10.16 72.39,12.7 72.39,71.12 71.12,72.39 X3.8
  Bottom 0.254: v39.37,2.54 v7.62,2.54 | v41.91,2.54 43.18,1.27 71.12,1.27 v72.39,2.54
GND  (via drill 0.61)
  Top 0.254: IC4.7 IC4.6 | v52.07,73.66 52.07,68.58 53.34,67.31 RESET.1 | v59.69,67.31 60.96,67.31 RESET.2 | v20.32,68.58 20.32,76.2 X2.24 | IC3.7 90.17,6.35 87.63,6.35 IC3.5 SV3.1 82.55,5.08 78.74,5.08 77.47,6.35 POWER.5 | 10.16,17.78 10.16,20.32 RESET1.3 | 10.16,17.78 10.16,12.7 | 10.16,17.78 7.62,20.32 7.62,25.4 2.54,25.4 X1.24 | D1.C 10.16,3.81 10.16,12.7 | 10.16,12.7 RESET1.4 | R4.2 50.8,35.56 | C4.2 v52.07,41.91 52.07,35.56 Q5.2 50.8,35.56 | 49.53,29.21 v46.99,26.67 | 49.53,29.21 C3.2 49.53,34.29 50.8,35.56 | 49.53,15.24 IC2.7 | 49.53,29.21 49.53,15.24 | JP6.2 49.53,11.43 49.53,15.24
  Bottom 0.254: IC4.7 IC4.8 | IC4.7 86.36,49.53 PWMH.7 99.06,62.23 99.06,67.31 ICSP.6 96.52,68.58 95.25,68.58 | v52.07,73.66 55.88,77.47 80.01,77.47 82.55,74.93 | 95.25,68.58 91.44,68.58 90.17,67.31 v59.69,67.31 21.59,67.31 v20.32,68.58 | 82.55,74.93 83.82,73.66 90.17,73.66 95.25,68.58 | 82.55,74.93 X3.11 | POWER.4 POWER.5 74.93,17.78 60.96,17.78 59.69,16.51 59.69,11.43 IC2.5 55.88,8.89 IC2.7 | SV1.1 77.47,3.81 78.74,2.54 81.28,2.54 SV3.1 | JP5.1 7.62,1.27 D1.C 39.37,1.27 JP6.2 | v52.07,41.91 ICSP1.6 | v46.99,26.67 Q1.2 | IC4.7 80.01,52.07 80.01,53.34 C4.2
N$1
  Top 0.254: SV1.2 64.77,5.08 64.77,13.97 ADCL.3
N$3
  Top 0.254: JP5.5 R8.2
N$6  (via drill 0.6)
  other vias: 55.88,54.61
N$11  (via drill 0.61)
  Top 0.254: JP7.2 v41.91,35.56
  Bottom 0.254: R7.1 43.18,35.56 v41.91,35.56
N$12  (via drill 0.61)
  Top 0.254: Q1.1 36.83,27.94 v36.83,31.75
  Bottom 0.254: R7.2 v36.83,31.75
N$26
  Top 0.254: JP6.1 36.83,5.08 ANT1.1
N$28
  Top 0.254: 15.24,12.7 15.24,20.32 RESET1.1 | JP5.7 15.24,8.89 15.24,12.7 | 15.24,12.7 RESET1.2
N$33  (via drill 0.61)
  Top 0.254: Q5.1 v53.34,54.61
  Bottom 0.254: R3.1 35.56,50.8 43.18,50.8 45.72,53.34 46.99,53.34 48.26,54.61 v53.34,54.61
N$40
  Bottom 0.254: R8.1 7.62,7.62 3.81,7.62 2.54,6.35 D1.A
QA
  Bottom 0.254: IC4.1 92.71,34.29 93.98,35.56 93.98,40.64 39.37,40.64 JP7.1
RA  (via drill 0.61)
  Top 0.254: R4.1 48.26,40.64 v48.26,41.91 | v55.88,43.18 v55.88,31.75
  Bottom 0.254: v48.26,41.91 49.53,43.18 v55.88,43.18 60.96,43.18 62.23,44.45 IC4.10 74.93,44.45 IC4.4 | C5.2 57.15,31.75 v55.88,31.75
RESET  (via drill 0.61)
  Top 0.254: v54.61,62.23 53.34,62.23 RESET.3 | v59.69,62.23 60.96,62.23 RESET.4 | POWER.1 91.44,15.24 91.44,10.16 92.71,8.89 96.52,8.89 96.52,62.23 97.79,63.5 ICSP.5
  Bottom 0.254: v54.61,62.23 v59.69,62.23 95.25,62.23 ICSP.5
VCC  (via drill 0.61)
  Top 0.254: v3.81,59.69 3.81,33.02 2.54,31.75 X1.22 | v85.09,68.58 86.36,67.31 86.36,35.56 83.82,33.02 83.82,30.48 86.36,27.94 86.36,10.16 83.82,7.62 81.28,7.62 | 81.28,7.62 80.01,7.62 SV3.6 | POWER.3 81.28,13.97 81.28,7.62
  Bottom 0.254: v3.81,59.69 13.97,69.85 55.88,69.85 57.15,68.58 v85.09,68.58
WLES  (via drill 0.61)
  Top 0.254: Q5.3 54.61,35.56 54.61,58.42 57.15,60.96 v57.15,69.85
  Bottom 0.254: v57.15,69.85 73.66,69.85 76.2,72.39 X3.6
WLX  (via drill 0.61)
  Top 0.254: Q1.3 38.1,29.21 v38.1,45.72 | v29.21,46.99 29.21,54.61 26.67,54.61 26.67,66.04 22.86,69.85 21.59,69.85 21.59,68.58 20.32,67.31 17.78,67.31 17.78,76.2 X2.25
  Bottom 0.254: v38.1,45.72 36.83,46.99 v29.21,46.99
~QA
  Bottom 0.254: R6.2 40.64,33.02 55.88,33.02 58.42,35.56 74.93,35.56 76.2,36.83 IC4.2
~QB  (via drill 0.61)
  Top 0.254: v41.91,46.99 R5.2 | v60.96,45.72 64.77,41.91 v64.77,39.37
  Bottom 0.254: v41.91,46.99 43.18,45.72 v60.96,45.72 | IC4.12 v64.77,39.37